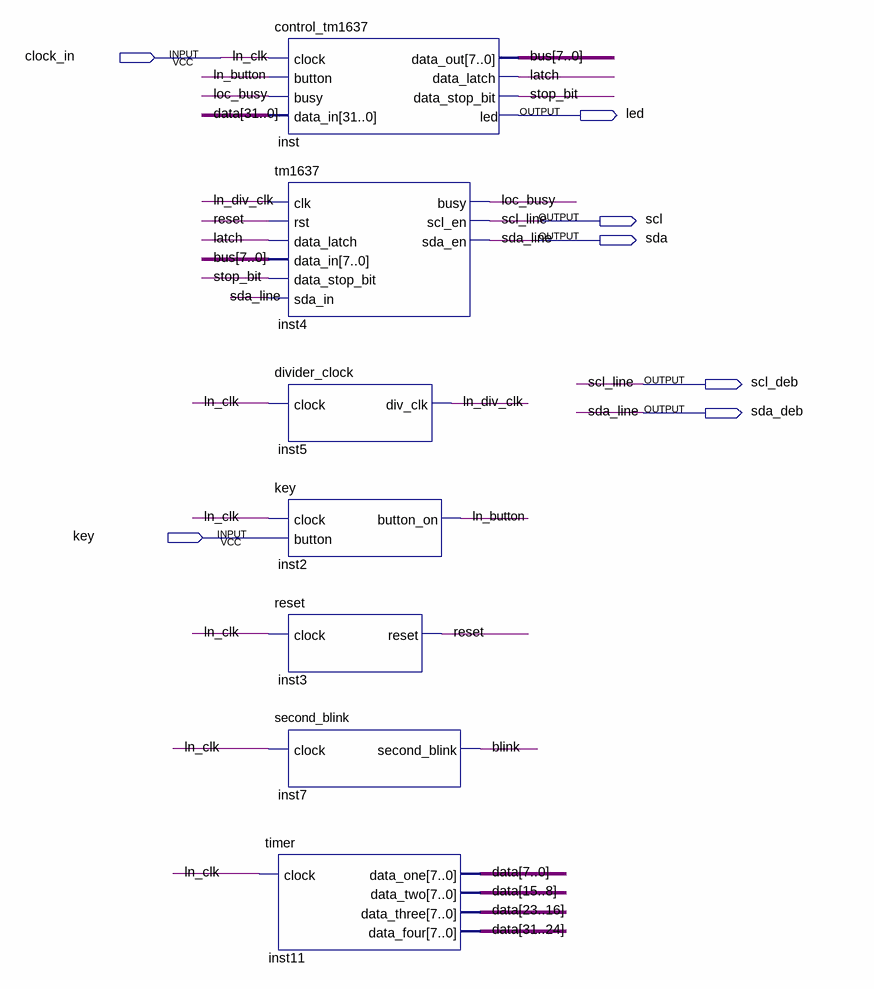
[diagram p0: schematic sheet]
// Quartus schematic TestTM1637.bdf as structural Verilog: 7 symbols, 7 pins
module TestTM1637 (
  input  clock_in,
  input  key,
  output led,
  output scl,
  output sda,
  output scl_deb,
  output sda_deb
);

  wire blink, latch, ln_button, ln_div_clk, loc_busy, reset, stop_bit;
  wire [7:0] bus;
  wire [31:0] data;

  control_tm1637 inst (
    .clock(clock_in), .button(ln_button), .busy(loc_busy), .data_in(data), .data_out(bus),
    .data_latch(latch), .data_stop_bit(stop_bit), .led(led));
  tm1637 inst4 (
    .clk(ln_div_clk), .rst(reset), .data_latch(latch), .data_in(bus), .data_stop_bit(stop_bit), .sda_in(sda),
    .busy(loc_busy), .scl_en(scl), .sda_en(sda));
  divider_clock inst5 (.clock(clock_in), .div_clk(ln_div_clk));
  key inst2 (.clock(clock_in), .button(key), .button_on(ln_button));
  reset inst3 (.clock(clock_in), .reset(reset));
  second_blink inst7 (.clock(clock_in), .second_blink(blink));
  timer inst11 (
    .clock(clock_in), .data_one(data[7:0]), .data_two(data[15:8]), .data_three(data[23:16]),
    .data_four(data[31:24]));

  assign scl_deb = scl;
  assign sda_deb = sda;

  // Other names for the same wires on the sheet: ln_clk = clock_in; scl_line = scl; sda_line = sda
endmodule
